# EAGLE design arm_driver (EAGLE 6.4)
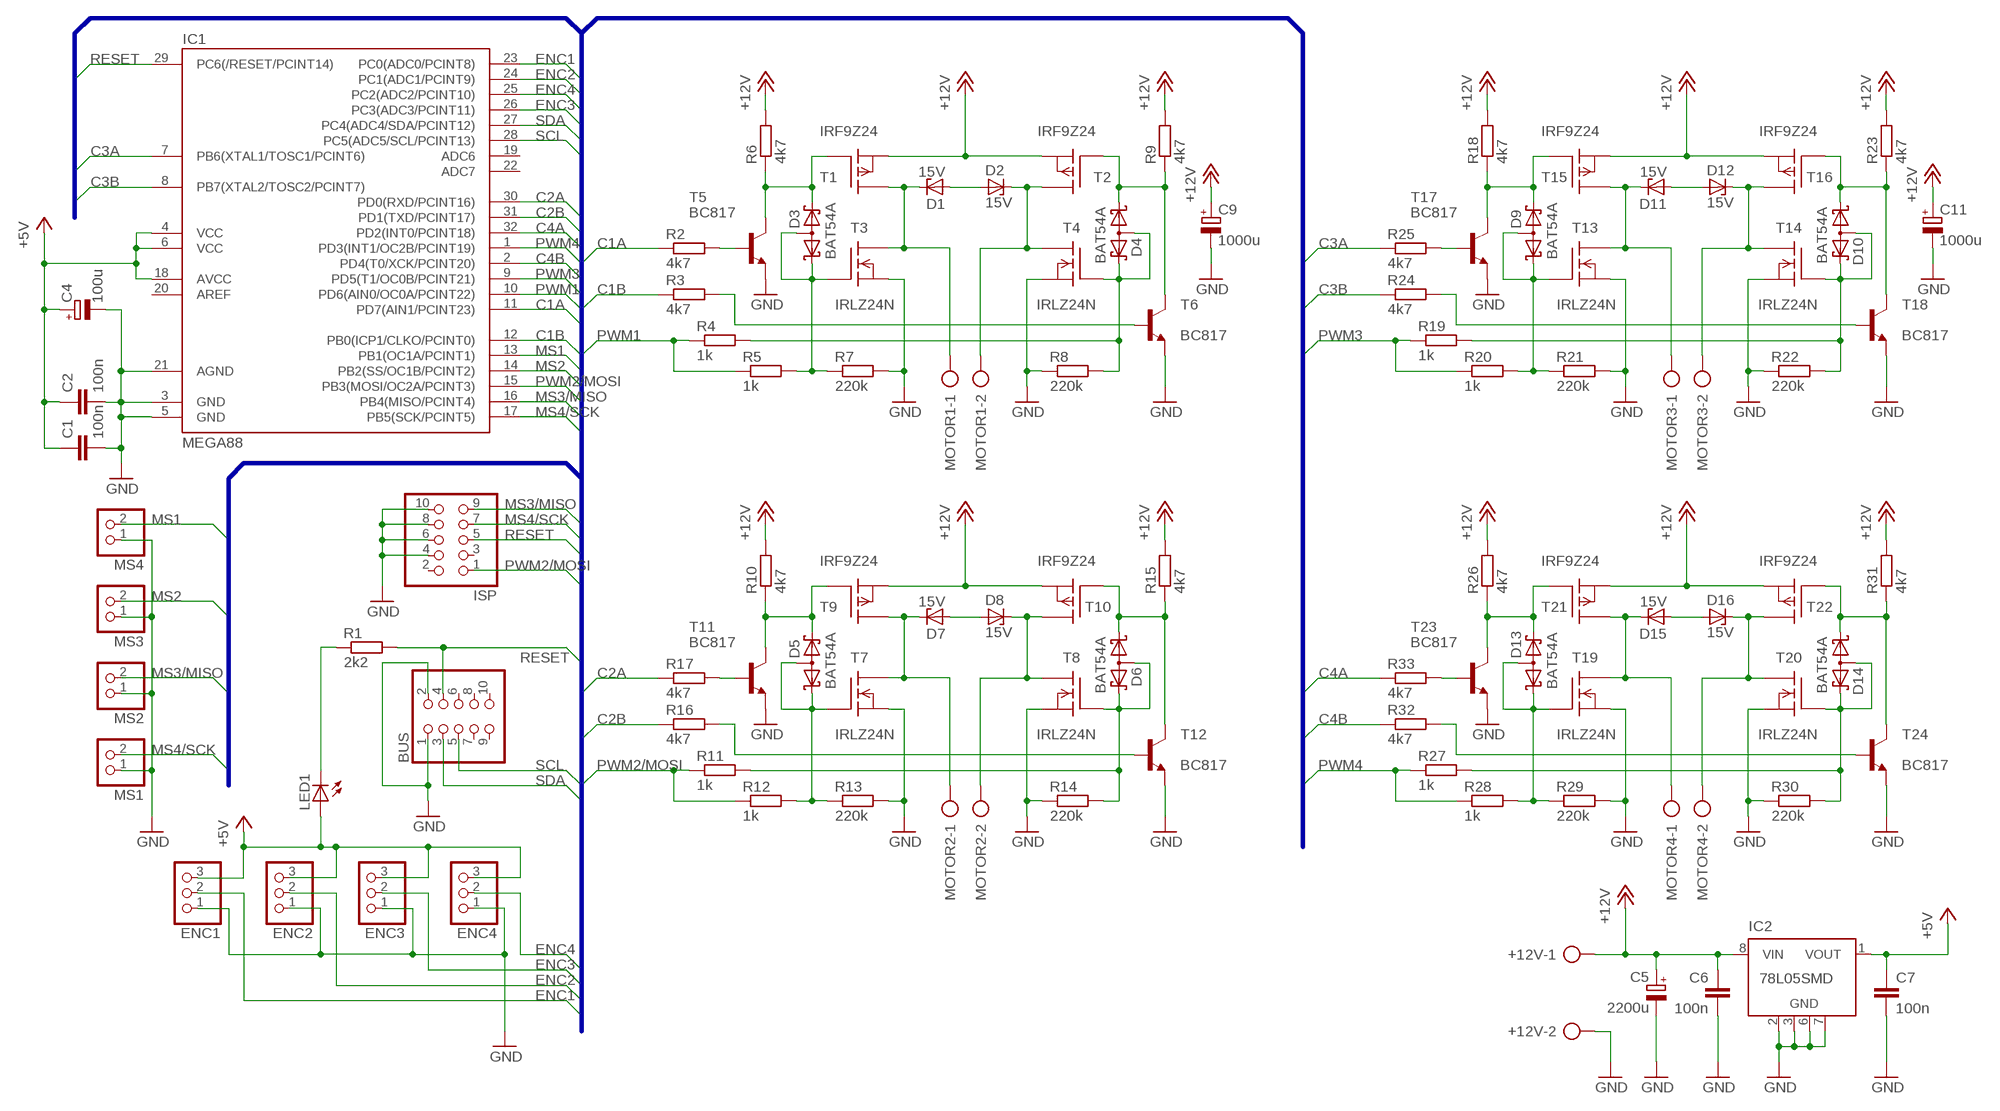
[diagram p0: schematic, sheet 1]

## Parts
+12V  AK500/2  [AK500/2]
BUS  PINHD-2X5  [2X05]
C1  100n  C-EUC1206  [C1206]
C2  100n  C-EUC1206  [C1206]
C4  100u  CPOL-EUD/7343-31R  [D/7343-31R]
C5  2200u  CPOL-EUE7.5-16  [E7,5-16]
C6  100n  C-EUC1206  [C1206]
C7  100n  C-EUC1206  [C1206]
C9  1000u  CPOL-EUE5-13  [E5-13]
C11  1000u  CPOL-EUE5-13  [E5-13]
D1  15V  ZENER-DIODESOD80C  [SOD80C]
D2  15V  ZENER-DIODESOD80C  [SOD80C]
D3  BAT54A  [SOT23]
D4  BAT54A  [SOT23]
D5  BAT54A  [SOT23]
D6  BAT54A  [SOT23]
D7  15V  ZENER-DIODESOD80C  [SOD80C]
D8  15V  ZENER-DIODESOD80C  [SOD80C]
D9  BAT54A  [SOT23]
D10  BAT54A  [SOT23]
D11  15V  ZENER-DIODESOD80C  [SOD80C]
D12  15V  ZENER-DIODESOD80C  [SOD80C]
D13  BAT54A  [SOT23]
D14  BAT54A  [SOT23]
D15  15V  ZENER-DIODESOD80C  [SOD80C]
D16  15V  ZENER-DIODESOD80C  [SOD80C]
ENC1  PINHD-1X3  [1X03]
ENC2  PINHD-1X3  [1X03]
ENC3  PINHD-1X3  [1X03]
ENC4  PINHD-1X3  [1X03]
IC1  MEGA88  MEGA48/88/168-AU  [TQFP32-08]
IC2  78L05SMD  [SO08]
ISP  PINHD-2X5  [2X05]
LED1  LEDKA-3528ASYC  [KA-3528ASYC]
MOTOR1  AK500/2  [AK500/2]
MOTOR2  AK500/2  [AK500/2]
MOTOR3  AK500/2  [AK500/2]
MOTOR4  AK500/2  [AK500/2]
MS1  PINHD-1X2  [1X02]
MS2  PINHD-1X2  [1X02]
MS3  PINHD-1X2  [1X02]
MS4  PINHD-1X2  [1X02]
R1  2k2  R-EU_R1206  [R1206]
R2  4k7  R-EU_R1206  [R1206]
R3  4k7  R-EU_R1206  [R1206]
R4  1k  R-EU_R1206  [R1206]
R5  1k  R-EU_R1206  [R1206]
R6  4k7  R-EU_R1206  [R1206]
R7  220k  R-EU_R1206  [R1206]
R8  220k  R-EU_R1206  [R1206]
R9  4k7  R-EU_R1206  [R1206]
R10  4k7  R-EU_R1206  [R1206]
R11  1k  R-EU_R1206  [R1206]
R12  1k  R-EU_R1206  [R1206]
R13  220k  R-EU_R1206  [R1206]
R14  220k  R-EU_R1206  [R1206]
R15  4k7  R-EU_R1206  [R1206]
R16  4k7  R-EU_R1206  [R1206]
R17  4k7  R-EU_R1206  [R1206]
R18  4k7  R-EU_R1206  [R1206]
R19  1k  R-EU_R1206  [R1206]
R20  1k  R-EU_R1206  [R1206]
R21  220k  R-EU_R1206  [R1206]
R22  220k  R-EU_R1206  [R1206]
R23  4k7  R-EU_R1206  [R1206]
R24  4k7  R-EU_R1206  [R1206]
R25  4k7  R-EU_R1206  [R1206]
R26  4k7  R-EU_R1206  [R1206]
R27  1k  R-EU_R1206  [R1206]
R28  1k  R-EU_R1206  [R1206]
R29  220k  R-EU_R1206  [R1206]
R30  220k  R-EU_R1206  [R1206]
R31  4k7  R-EU_R1206  [R1206]
R32  4k7  R-EU_R1206  [R1206]
R33  4k7  R-EU_R1206  [R1206]
T1  IRF9Z24  IRF9530  [TO220]
T2  IRF9Z24  IRF9530  [TO220]
T3  IRLZ24N  IRF540  [TO220]
T4  IRLZ24N  IRF540  [TO220]
T5  BC817  BC817-16-NPN-SOT23-BEC  [SOT23-BEC]
T6  BC817  BC817-16-NPN-SOT23-BEC  [SOT23-BEC]
T7  IRLZ24N  IRF540  [TO220]
T8  IRLZ24N  IRF540  [TO220]
T9  IRF9Z24  IRF9530  [TO220]
T10  IRF9Z24  IRF9530  [TO220]
T11  BC817  BC817-16-NPN-SOT23-BEC  [SOT23-BEC]
T12  BC817  BC817-16-NPN-SOT23-BEC  [SOT23-BEC]
T13  IRLZ24N  IRF540  [TO220]
T14  IRLZ24N  IRF540  [TO220]
T15  IRF9Z24  IRF9530  [TO220]
T16  IRF9Z24  IRF9530  [TO220]
T17  BC817  BC817-16-NPN-SOT23-BEC  [SOT23-BEC]
T18  BC817  BC817-16-NPN-SOT23-BEC  [SOT23-BEC]
T19  IRLZ24N  IRF540  [TO220]
T20  IRLZ24N  IRF540  [TO220]
T21  IRF9Z24  IRF9530  [TO220]
T22  IRF9Z24  IRF9530  [TO220]
T23  BC817  BC817-16-NPN-SOT23-BEC  [SOT23-BEC]
T24  BC817  BC817-16-NPN-SOT23-BEC  [SOT23-BEC]

## Nets
+5V: C1.1 C2.1 C4.+ C7.1 ENC1.3 ENC2.3 ENC3.3 ENC4.3 IC1.4(VCC) IC1.6(VCC) IC1.18(AVCC) IC2.1(VOUT) LED1.A
+12V: +12V.1 C5.+ C6.1 C9.+ C11.+ IC2.8(VIN) R6.2 R9.2 R10.2 R15.2 R18.2 R23.2 R26.2 R31.2 T1.3(S) T2.3(S) T9.3(S) T10.3(S) T15.3(S) T16.3(S) T21.3(S) T22.3(S)
C1A: IC1.11(PD7(AIN1/PCINT23)) R2.1
C1B: IC1.12(PB0(ICP1/CLKO/PCINT0)) R3.1
C2A: IC1.30(PD0(RXD/PCINT16)) R17.1
C2B: IC1.31(PD1(TXD/PCINT17)) R16.1
C3A: IC1.7(PB6(XTAL1/TOSC1/PCINT6)) R25.1
C3B: IC1.8(PB7(XTAL2/TOSC2/PCINT7)) R24.1
C4A: IC1.32(PD2(INT0/PCINT18)) R33.1
C4B: IC1.2(PD4(T0/XCK/PCINT20)) R32.1
ENC1: ENC1.2 IC1.23(PC0(ADC0/PCINT8))
ENC2: ENC2.2 IC1.24(PC1(ADC1/PCINT9))
ENC3: ENC3.2 IC1.26(PC3(ADC3/PCINT11))
ENC4: ENC4.2 IC1.25(PC2(ADC2/PCINT10))
GND: +12V.2 BUS.1 BUS.2 C1.2 C2.2 C4.- C5.- C6.2 C7.2 C9.- C11.- ENC1.1 ENC2.1 ENC3.1 ENC4.1 IC1.3(GND) IC1.5(GND) IC1.21(AGND) IC2.2(GND) IC2.3(GND) IC2.6(GND) IC2.7(GND) ISP.4 ISP.6 ISP.8 ISP.10 MS1.1 MS2.1 MS3.1 MS4.1 R7.2 R8.1 R13.2 R14.1 R21.2 R22.1 R29.2 R30.1 T3.3(S) T4.3(S) T5.E T6.E T7.3(S) T8.3(S) T11.E T12.E T13.3(S) T14.3(S) T17.E T18.E T19.3(S) T20.3(S) T23.E T24.E
MS1: IC1.13(PB1(OC1A/PCINT1)) MS4.2
MS2: IC1.14(PB2(SS/OC1B/PCINT2)) MS3.2
MS3/MISO: IC1.16(PB4(MISO/PCINT4)) ISP.9 MS2.2
MS4/SCK: IC1.17(PB5(SCK/PCINT5)) ISP.7 MS1.2
N$1: LED1.C R1.1
N$2: D2.C MOTOR1.2 T2.2(D) T4.2(D)
N$3: D1.A D2.A
N$4: D3.2(K2) R6.1 T1.1(G) T5.C
N$5: D4.1(K1) R9.1 T2.1(G) T6.C
N$6: D4.2(K2) D4.3(AA) R4.2 R8.2 T4.1(G)
N$8: R3.2 T6.B
N$9: R2.2 T5.B
N$10: D3.1(K1) D3.3(AA) R5.2 R7.1 T3.1(G)
N$14: D1.C MOTOR1.1 T1.2(D) T3.2(D)
N$17: D7.C MOTOR2.1 T7.2(D) T9.2(D)
N$18: D8.C MOTOR2.2 T8.2(D) T10.2(D)
N$19: D5.2(K2) R10.1 T9.1(G) T11.C
N$20: D6.1(K1) R15.1 T10.1(G) T12.C
N$21: D6.2(K2) D6.3(AA) R11.2 R14.2 T8.1(G)
N$22: D5.1(K1) D5.3(AA) R12.2 R13.1 T7.1(G)
N$23: D7.A D8.A
N$25: R16.2 T12.B
N$26: R17.2 T11.B
N$27: D11.C MOTOR3.1 T13.2(D) T15.2(D)
N$28: D12.C MOTOR3.2 T14.2(D) T16.2(D)
N$29: D9.2(K2) R18.1 T15.1(G) T17.C
N$30: D10.1(K1) R23.1 T16.1(G) T18.C
N$31: D10.2(K2) D10.3(AA) R19.2 R22.2 T14.1(G)
N$32: D9.1(K1) D9.3(AA) R20.2 R21.1 T13.1(G)
N$33: D11.A D12.A
N$35: R24.2 T18.B
N$36: R25.2 T17.B
N$37: D15.C MOTOR4.1 T19.2(D) T21.2(D)
N$38: D16.C MOTOR4.2 T20.2(D) T22.2(D)
N$39: D13.2(K2) R26.1 T21.1(G) T23.C
N$40: D14.1(K1) R31.1 T22.1(G) T24.C
N$41: D14.2(K2) D14.3(AA) R27.2 R30.2 T20.1(G)
N$42: D13.1(K1) D13.3(AA) R28.2 R29.1 T19.1(G)
N$43: D15.A D16.A
N$45: R32.2 T24.B
N$46: R33.2 T23.B
PWM1: IC1.10(PD6(AIN0/OC0A/PCINT22)) R4.1 R5.1
PWM2/MOSI: IC1.15(PB3(MOSI/OC2A/PCINT3)) ISP.1 R11.1 R12.1
PWM3: IC1.9(PD5(T1/OC0B/PCINT21)) R19.1 R20.1
PWM4: IC1.1(PD3(INT1/OC2B/PCINT19)) R27.1 R28.1
RESET: BUS.4 IC1.29(PC6(/RESET/PCINT14)) ISP.5 R1.2
SCL: BUS.5 IC1.28(PC5(ADC5/SCL/PCINT13))
SDA: BUS.3 IC1.27(PC4(ADC4/SDA/PCINT12))
Unconnected: BUS.6 BUS.7 BUS.8 BUS.9 BUS.10 IC1.19(ADC6) IC1.20(AREF) IC1.22(ADC7) IC2.4(NC) IC2.5(NC) ISP.2 ISP.3

## Buses
B$1

## Library data of the parts
+12V MOTOR1-MOTOR4 = con-ptr500:AK500/2: CONNECTOR; OC_FARNELL: unknown; OC_NEWARK: unknown
BUS ISP = pinhead:PINHD-2X5: PIN HEADER
C1 C2 C6 C7 = rcl:C-EU: CAPACITOR, European symbol
C4 C5 C9 C11 = rcl:CPOL-EU: POLARIZED CAPACITOR, European symbol
D1 D2 D7 D8 D11 D12 D15 D16 = diode:ZENER-DIODE: Z-Diode
D3-D6 D9 D10 D13 D14 = diode:BAT54A: Schottky Diodes Source: Fairchild .. BAT54.pdf
ENC1-ENC4 = pinhead:PINHD-1X3: PIN HEADER
IC1 = avr-6:MEGA48/88/168
IC2 = linear:78L*SMD: Positive VOLTAGE REGULATOR
LED1 = led:LED: LED OSRAM: - CHIPLED LG R971, LG N971, LY N971, LG Q971, LY Q971, LO R971, LY R971 LH N974, LH R974 LS Q976, LO Q976, LY Q976 LO Q996 - Hyper CHIPLED LW Q18S LB Q993, LB Q99A, LB R99A - SideLED LS A670, LO A670, LY A670, LG A670, LP A670 LB A673, LV A673, LT A673, LW A673 LH A674 LY A675 LS A676, LA A676, LO A676, LY A676, LW A676 LS A679, LY A679, LG A679 - Hyper Micro SIDELED® LS Y876, LA Y876, LO Y876, LY Y876 LT Y87S - SmartLED LW L88C, LW L88S LB L89C, LB L89S, LG L890 LS L89K, LO L89K, LY L89K LS L896, LA L896, LO L896, LY L896 - TOPLED LS T670, LO T670, LY T670, LG T670, LP T670 LSG T670, LSP T670, LSY T670, LOP T670, LYG T670 LG T671, LOG T671, LSG T671 LB T673, LV T673, LT T673, LW T673 LH T674 LS T676, LA T676, LO T676, LY T676, LB T676, LH T676, LSB T676, LW T676 LB T67C, LV T67C, LT T67C, LS T67K, LO T67K, LY T67K, LW E67C LS E67B, LA E67B, LO E67B, LY E67B, LB E67C, LV E67C, LT E67C LW T67C LS T679, LY T679, LG T679 LS T770, LO T770, LY T770, LG T770, LP T770 LB T773, LV T773, LT T773, LW T773 LH T774 LS E675, LA E675, LY E675, LS T675 LS T776, LA T776, LO T776, LY T776, LB T776 LHGB T686 LT T68C, LB T68C - Hyper Mini TOPLED® LB M676 - Mini TOPLED Santana® LG M470 LS M47K, LO M47K, LY M47K Source: http://www.osram.convergy.de LUXEON: - LUMILED® LXK2-PW12-R00, LXK2-PW12-S00, LXK2-PW14-U00, LXK2-PW14-V00 LXK2-PM12-R00, LXK2-PM12-S00, LXK2-PM14-U00 LXK2-PE12-Q00, LXK2-PE12-R00, LXK2-PE12-S00, LXK2-PE14-T00, LXK2-PE14-U00 LXK2-PB12-K00, LXK2-PB12-L00, LXK2-PB12-M00, LXK2-PB14-N00, LXK2-PB14-P00, LXK2-PB14-Q00 LXK2-PR12-L00, LXK2-PR12-M00, LXK2-PR14-Q00, LXK2-PR14-R00 LXK2-PD12-Q00, LXK2-PD12-R00, LXK2-PD12-S00 LXK2-PH12-R00, LXK2-PH12-S00 LXK2-PL12-P00, LXK2-PL12-Q00, LXK2-PL12-R00 Source: www.luxeon.com KINGBRIGHT: KA-3528ASYC Source: www.kingbright.com
MS1-MS4 = pinhead:PINHD-1X2: PIN HEADER
R1-R33 = rcl:R-EU_: RESISTOR, European symbol
T1 T2 T9 T10 T15 T16 T21 T22 = transistor-fet:IRF9530: P-Channel Enhancement MOSFET (HEXFET); -100V; -12A; 0,3Ohm
T3 T4 T7 T8 T13 T14 T19 T20 = transistor-fet:IRF540: N-Channel Enhancement MOSFET (HEXFET); 100V; 28A; 0,077Ohm
T5 T6 T11 T12 T17 T18 T23 T24 = transistor:*-NPN-: NPN Transistror BF959 corrected 2008.03.06

## Board
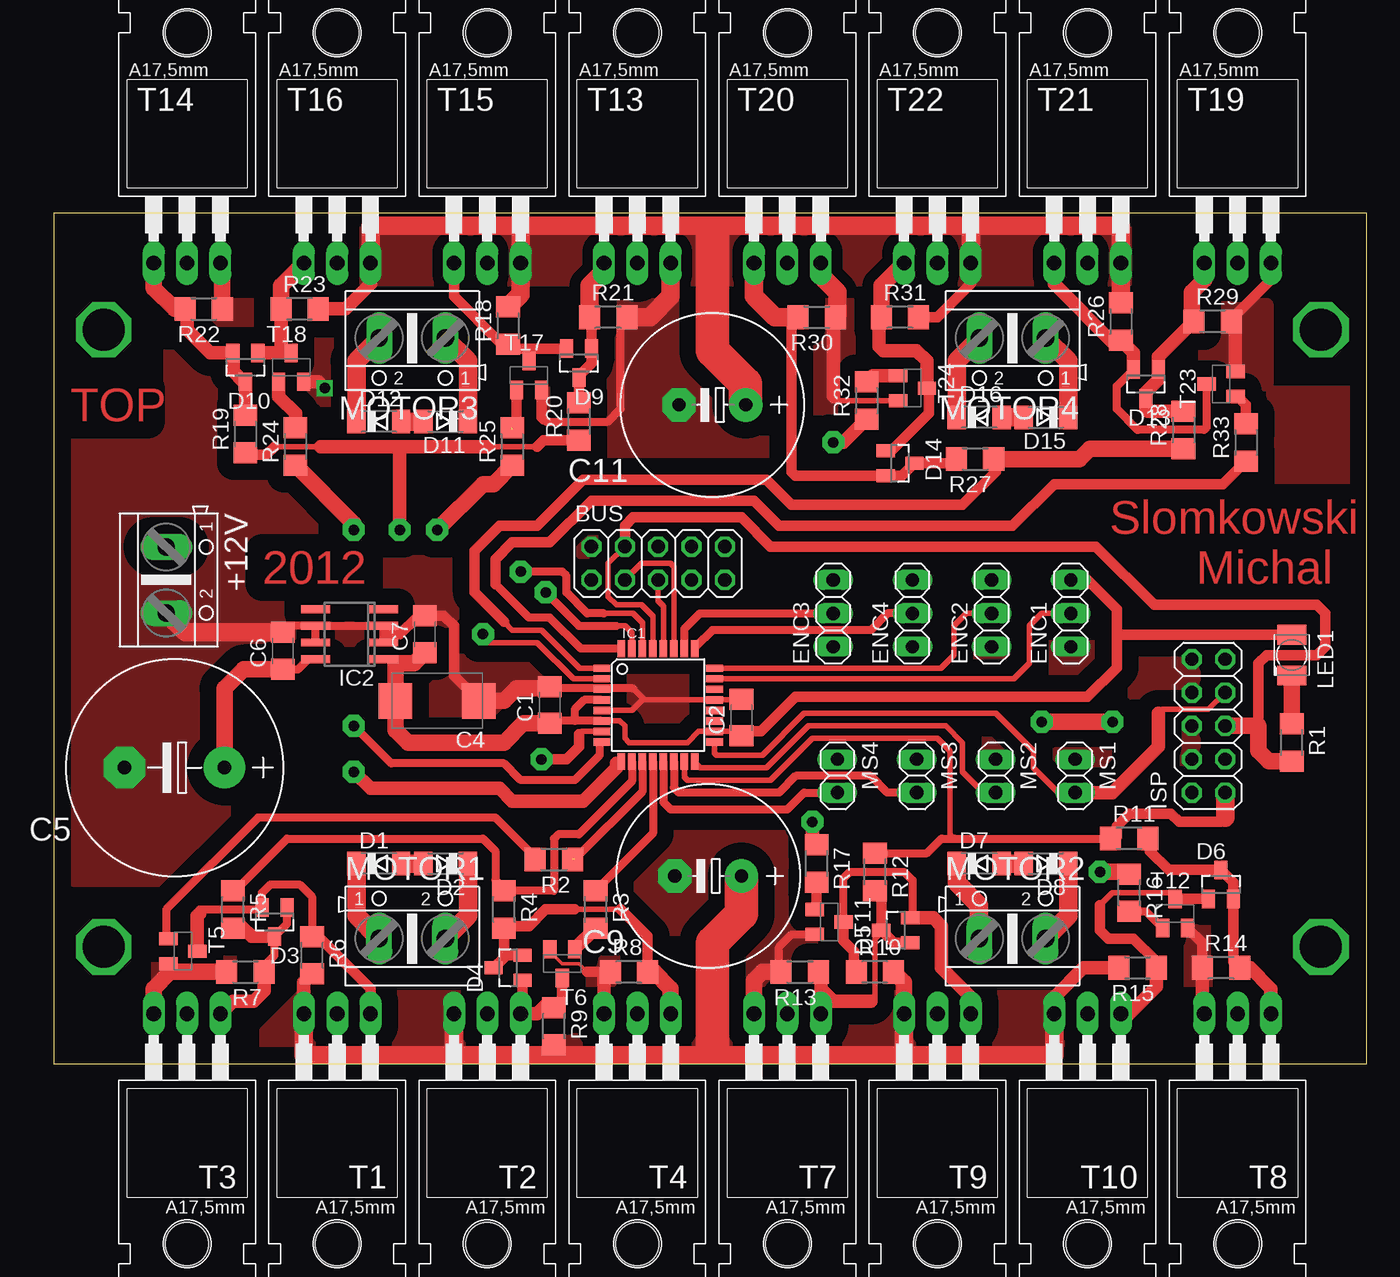
[diagram p1: board, top side]
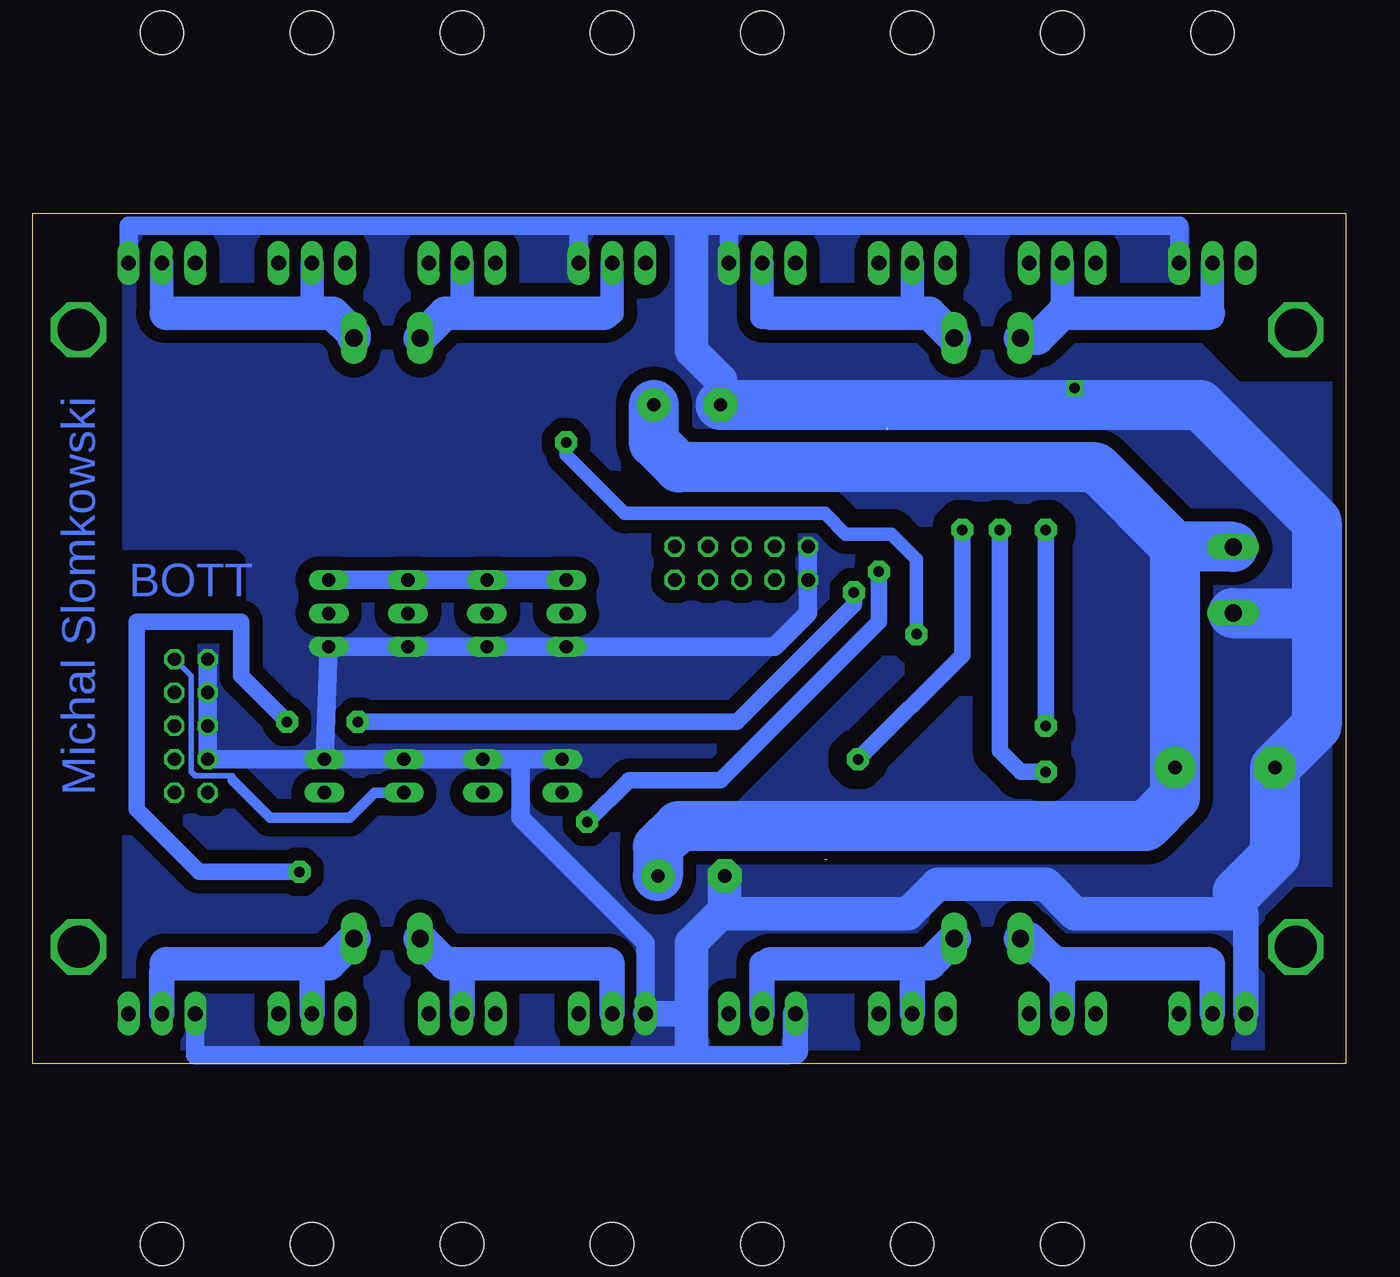
[diagram p2: board, bottom side, seen from below]

Size 100 x 64.76 mm. Coordinates in mm from the lower left corner, seen from the top.
Outline: 0,0 100,0 100,64.76 0,64.76 0,0
Copper layers (1*16): Top 0.035mm / dielectric 1.5mm / Bottom 0.035mm
Design rules "default": minimum track width 10mil, minimum drill 24mil, track to track 8mil, track to pad 8mil, pad to pad 8mil, via to via 8mil, smd to smd 8mil, copper to edge 40mil, drill to drill 8mil, minimum pad ring 10mil, minimum via ring 8mil, stop-mask expansion 4mil, vias tented up to drill 0mil, thermal gap 10mil

### Footprints (pad centres in the part's own frame; a part is rotated, then mirrored left to right if it is on the bottom)
AK500/2 = drill 1.321 long: 1 -2.515,0; 2 2.515,0
2X05 = drill 1.016 octagon: 1 -5.08,-1.27; 2 -5.08,1.27; 3 -2.54,-1.27; 4 -2.54,1.27; 5 0,-1.27; 6 0,1.27; 7 2.54,-1.27; 8 2.54,1.27; 9 5.08,-1.27; 10 5.08,1.27
C1206 = smd 1.6 x 1.8: 1 -1.4,0; 2 1.4,0
D/7343-31R = smd 2.55 x 2.7: + 3.175,0; - -3.175,0
E7,5-16 = drill 1.016 pad 3.15: + -3.81,0 | drill 1.016 pad 3.15 octagon: - 3.81,0
E5-13 = drill 1.016 pad 2.54: + -2.54,0 | drill 1.016 pad 2.54 octagon: - 2.54,0
SOD80C = smd 1.4 x 1.8: A 1.7,0; C -1.7,0
SOT23 = smd 1 x 1.4: 1 -0.95,-1.1; 2 0.95,-1.1; 3 0,1.1
1X03 = drill 1.016 long: 1 -2.54,0; 2 0,0; 3 2.54,0
TQFP32-08 = smd 1.27 x 0.559: 1 -4.293,2.8; 2 -4.293,2; 3 -4.293,1.2; 4 -4.293,0.4; 5 -4.293,-0.4; 6 -4.293,-1.2; 7 -4.293,-2; 8 -4.293,-2.8; 17 4.293,-2.8; 18 4.293,-2; 19 4.293,-1.2; 20 4.293,-0.4; 21 4.293,0.4; 22 4.293,1.2; 23 4.293,2; 24 4.293,2.8 | smd 0.559 x 1.27: 9 -2.8,-4.293; 10 -2,-4.293; 11 -1.2,-4.293; 12 -0.4,-4.293; 13 0.4,-4.293; 14 1.2,-4.293; 15 2,-4.293; 16 2.8,-4.293; 25 2.8,4.293; 26 2,4.293; 27 1.2,4.293; 28 0.4,4.293; 29 -0.4,4.293; 30 -1.2,4.293; 31 -2,4.293; 32 -2.8,4.293
SO08 = smd 0.6 x 2.2: 1 -1.905,-2.6; 2 -0.635,-2.6; 3 0.635,-2.6; 4 1.905,-2.6; 5 1.905,2.6; 6 0.635,2.6; 7 -0.635,2.6; 8 -1.905,2.6
KA-3528ASYC = smd 1.5 x 2.2: A -1.55,0; C 1.55,0
1X02 = drill 1.016 long: 1 -1.27,0; 2 1.27,0
R1206 = smd 1.6 x 1.803: 1 -1.422,0; 2 1.422,0
TO220 = drill 1.118 long: 1 -2.54,-6.35; 2 0,-6.35; 3 2.54,-6.35 | hole 3.302: 0,11.176
SOT23-BEC = smd 1 x 1.4: B -0.95,-1.1; C 0,1.1; E 0.95,-1.1

### Placement (x,y rotation side)
+12V  8.57,36.83 270 top
BUS  46.04,38.1 0 top
C1  37.78,27.3 90 top
C2  52.39,26.35 90 top
C4  29.21,27.62 180 top
C5  9.21,22.54 180 top
C6  17.46,31.43 90 top
C7  28.26,32.7 90 top
C9  49.85,14.29 180 top
C11  50.16,50.16 180 top
D1  24.77,15.24 0 top
D2  29.84,15.24 180 top
D3  16.83,10.79 180 top
D4  34.61,7.3 90 top
D5  64.14,10.16 90 top
D6  88.9,13.65 0 top
D7  70.48,15.24 0 top
D8  75.56,15.24 180 top
D9  40.01,53.34 180 top
D10  14.61,53.02 180 top
D11  29.84,48.9 180 top
D12  24.77,48.9 0 top
D13  83.19,51.75 180 top
D14  64.45,45.72 270 top
D15  75.56,49.21 180 top
D16  70.48,49.21 0 top
ENC1  77.47,34.29 90 top
ENC2  71.44,34.29 90 top
ENC3  59.37,34.29 90 top
ENC4  65.41,34.29 90 top
IC1  46.04,27.3 0 top
IC2  22.54,32.7 90 top
ISP  87.95,25.72 90 top
LED1  94.3,31.11 270 top
MOTOR1  27.3,9.53 0 top
MOTOR2  73.03,9.53 0 top
MOTOR3  27.3,55.24 180 top
MOTOR4  73.03,55.24 180 top
MS1  77.79,21.91 270 top
MS2  71.75,21.91 270 top
MS3  65.72,21.91 270 top
MS4  59.69,21.91 270 top
R1  94.3,24.45 270 top
R2  38.1,15.56 180 top
R3  41.27,11.75 270 top
R4  34.29,11.75 270 top
R5  13.65,11.75 270 top
R6  19.68,8.26 270 top
R7  14.61,6.99 180 top
R8  43.81,6.99 0 top
R9  38.1,2.86 270 top
R10  62.55,6.99 0 top
R11  81.92,17.14 0 top
R12  62.55,14.61 270 top
R13  56.83,6.99 180 top
R14  88.9,7.3 0 top
R15  82.55,7.3 180 top
R16  81.92,13.02 270 top
R17  58.1,15.24 270 top
R18  34.61,56.2 90 top
R19  14.61,47.94 90 top
R20  40.01,48.9 90 top
R21  42.23,56.83 0 top
R22  11.43,57.47 180 top
R23  18.73,57.47 0 top
R24  18.41,46.99 90 top
R25  34.92,46.99 90 top
R26  81.28,56.52 90 top
R27  70.17,46.04 180 top
R28  86.04,48.26 90 top
R29  88.27,56.52 0 top
R30  58.1,56.83 180 top
R31  64.45,56.83 0 top
R32  61.91,50.48 90 top
R33  90.81,47.31 90 top
T1  21.59,-2.54 180 top
T2  33.02,-2.54 180 top
T3  10.16,-2.54 180 top
T4  44.45,-2.54 180 top
T5  9.84,8.57 270 top
T6  38.73,7.62 180 top
T7  55.88,-2.54 180 top
T8  90.17,-2.54 180 top
T9  67.31,-2.54 180 top
T10  78.74,-2.54 180 top
T11  59.05,10.79 270 top
T12  85.41,11.43 0 top
T13  44.45,67.31 0 top
T14  10.16,67.31 0 top
T15  33.02,67.31 0 top
T16  21.59,67.31 0 top
T17  36.2,52.39 0 top
T18  18.1,53.02 0 top
T19  90.17,67.31 0 top
T20  55.88,67.31 0 top
T21  78.74,67.31 0 top
T22  67.31,67.31 0 top
T23  88.9,51.75 90 top
T24  65.41,51.44 270 top

### Tracks (layer width: path | path; a pad name or v marks a point on that pad's centre or on a via)
+5V
  Top 0.406: IC1.6 43.11,26.11 43.5,25.72 43.5,24.77 43.81,24.45 48.26,24.45 49.12,25.3 IC1.18 52.03,25.3 C2.1
  Top 0.61: IC1.6 39.69,26.11 | 39.69,26.11 37.98,26.11 C1.1 | IC1.4 40.41,27.7 39.69,26.99 39.69,26.11 | IC2.1 25.72,30.8 26.04,30.48
  Top 0.813: 52.03,25.3 53.88,25.3 56.52,27.94 78.74,27.94 80.96,30.16 80.96,32.7 | 80.96,32.7 80.96,34.61 78.74,36.83 ENC1.3 | LED1.A 81,32.66 80.96,32.7
  Top 1.27: C1.1 35.75,25.91 34.29,24.45 26.99,24.45 26.04,25.4 C4.+ 26.04,30.48 27.43,30.48 C7.1
  Bottom 1.422: ENC3.3 ENC4.3 ENC2.3 ENC1.3
+12V
  Top 0.406: R9.2 38.42,0.95 38.42,0.64
  Top 0.61: C6.1 18.6,30.03 19.37,30.8 IC2.8
  Top 0.813: T22.3 69.85,59.37 67.31,56.83 R31.2
  Top 1.016: T1.3 19.05,6.2 R6.2 | R15.2 78.42,7.3 76.2,5.08 T10.3 | T16.3 24.13,59.37 22.23,57.47 R23.2
  Top 1.27: T9.3 64.77,6.18 R10.2 | C6.1 14.47,30.03 13.02,28.57 C5.+
  Top 1.422: T1.3 19.05,0.64 30.48,0.64 | 30.48,0.64 T2.3 | T10.3 76.2,0.64 65.09,0.64 | 30.48,0.64 38.42,0.64 49.85,0.64 | 49.85,0.64 65.09,0.64 | T9.3 64.77,0.95 65.09,0.64 | 50.16,1.27 50.16,0.95 49.85,0.64 | 69.85,63.82 81.28,63.82 T21.3 R26.2 | 69.85,63.82 T22.3 | T16.3 24.13,63.82 35.56,63.82 | 35.56,63.82 50.16,63.82 | 50.16,63.82 69.85,63.82 | 35.56,63.82 T15.3 35.56,58.57 R18.2 | 50.16,63.82 50.16,63.18
  Top 2.54: C9.+ 52.39,11.43 50.16,9.21 50.16,1.27 | 50.16,63.18 50.16,54.29 52.7,51.75 C11.+
  Bottom 3.81: C9.+ 52.39,16.51 50.8,18.1 15.24,18.1 13.02,20.32 C5.+ 13.02,39.37 | +12V.1 12.99,39.34 13.02,39.37 | 13.02,39.37 19.05,45.4 50.8,45.4 52.7,47.31 C11.+
  pour Top (isolate 0.813, no thermals): 23.5,64.45 81.92,64.45 81.92,59.37 23.5,59.37
  pour Top (isolate 1.27, no thermals): 15.88,0.32 76.83,0.32 76.83,5.4 18.73,5.4 15.88,2.54
  pour Bottom (isolate 1.422, no thermals): 21.27,45.09 19.68,45.09 13.97,39.37 13.97,18.41 46.99,18.41 46.99,44.77 46.67,45.09
C1A  (1 unrouted)
  Top 0.61: IC1.11 44.84,20.71 39.69,15.56
C1B
  Top 0.61: IC1.12 45.64,17.53 R3.1
C2A  (via drill 0.8 pad 1.68)
  Top 0.406: IC1.30 44.84,33.59 44.13,34.29 41.91,34.29
  Top 0.61: 41.91,34.29 40.64,34.29 39.05,35.88 39.05,37.15 38.73,37.47 v35.56,37.47
  Top 1.016: v57.78,18.41 57.78,16.98 R17.1
  Bottom 1.27: v35.56,37.47 35.56,33.66 47.62,21.59 54.61,21.59 v57.78,18.41
C2B  (via drill 0.8 pad 1.68)
  Top 0.406: IC1.31 44.04,32.8 43.5,33.34 42.86,33.34
  Top 0.61: v37.47,35.88 40.01,33.34 42.86,33.34
  Top 1.27: v75.25,26.04 v80.64,26.04 | v79.69,14.61 81.75,14.61 R16.1
  Bottom 1.27: v75.25,26.04 46.35,26.04 37.47,34.92 v37.47,35.88 | v80.64,26.04 84.14,29.53 84.14,33.66 92.08,33.66 92.08,19.37 87.31,14.61 v79.69,14.61
C3A  (via drill 0.8 pad 1.68)
  Top 0.406: IC1.7 40.23,25.3 40.01,25.08
  Top 0.813: 40.01,25.08 40.01,24.13 39.05,23.18 v37.15,23.18
  Top 1.27: 34.77,45.57 R25.1 33.49,44.13 32.7,44.13 v29.21,40.64
  Bottom 1.27: v37.15,23.18 29.21,31.11 v29.21,40.64
C3B  (via drill 0.8 pad 1.68)
  Top 0.406: IC1.8 41.74,24.28 41.59,24.13
  Top 0.61: 41.59,24.13 41.59,23.5 39.69,21.59 35.56,21.59 34.29,22.86 25.72,22.86 v22.86,25.72
  Top 1.27: v22.86,40.64 22.86,41.12 R24.1
  Bottom 1.27: v22.86,25.72 v22.86,40.64
C4A
  Top 0.61: IC1.32 40.16,31.6 37.78,33.97 36.2,33.97 33.66,36.51
  Top 0.813: 33.66,36.51 33.66,38.42 34.92,39.69 37.78,39.69 40.96,42.86 53.34,42.86 55.24,40.96 73.03,40.96 76.2,44.13 89.05,44.13 R33.1
C4B  (via drill 0.8 pad 1.68)
  Top 0.406: IC1.2 39.59,29.3 36.83,32.07 33.02,32.07 v32.7,32.7
  Top 1.016: v59.37,47.31 60.16,47.31 R32.1
  Bottom 1.016: v32.7,32.7 32.7,38.42 34.61,40.32 38.1,40.32 39.69,41.91 54.93,41.91 59.37,46.35 v59.37,47.31
ENC1
  Top 0.406: IC1.23 73.12,29.3 74.3,30.48 74.3,33.34 75.25,34.29 ENC1.2
ENC2
  Top 0.406: IC1.24 67.57,30.11 68.58,31.11 68.58,33.34 69.53,34.29 ENC2.2
ENC3
  Top 0.61: IC1.26 48.04,33.12 49.21,34.29 ENC3.2
ENC4
  Top 0.406: IC1.25 48.84,31.69 48.9,31.75
  Top 0.61: ENC4.2 63.5,34.29 62.23,33.02 50.16,33.02 48.9,31.75
GND  (via drill 0.8)
  Top 0.254: T6.E 37.78,8.57 38.73,7.62 40.01,7.62 40.64,6.99
  Top 0.406: 44.93,27.78 44.13,28.57 41.81,28.57 IC1.3 | 44.93,27.78 45,27.7 IC1.21 52.39,27.7 C2.2 | IC1.5 44.05,26.91 44.93,27.78 | T24.E 59.37,50.48 59.37,50.8
  Top 0.61: T11.E 56.2,9.85 55.24,8.89 55.24,7.15 R13.2 | 37.3,49.06 37.47,48.9 42.23,48.9 43.18,49.85 43.18,56.36 R21.2 | 44.13,28.57 37.78,28.57 C1.2 | IC2.6 IC2.3 | IC2.7 IC2.6 | IC2.2 IC2.3 | IC2.6 17.97,33.34 C6.2 | IC2.3 25.14,32.96 25.4,32.7
  Top 0.813: T5.E 8.74,7.13 8.89,6.99 | R14.1 87.48,9.21 T12.E | 40.64,6.99 R8.1 | T19.3 92.71,59.69 89.85,56.83 89.85,56.68 R29.2 | T17.E 37.15,49.22 37.3,49.06 | C4.- 30.48,29.53 30.48,33.34 29.71,34.1 C7.2 28.13,33.97 27.62,33.97 26.35,32.7 25.4,32.7
  Top 1.016: R14.1 87.48,3.96 T8.3 | T4.3 41.91,6.5 R8.1 | T23.E 90,56.2 R29.2 | 59.37,50.8 59.37,56.68 R30.1 | T18.E 20.15,51.92 v20.64,51.44
  Top 1.27: R7.2 8.89,6.99 7.62,5.71 T3.3 | T7.3 53.34,6.35 53.98,6.99 R13.2 | R22.1 12.85,60.81 T14.3 | 37.78,28.57 35.24,28.57 34.29,27.62 C4.-
  Top 1.422: R21.2 45.4,56.83 46.99,58.42 T13.3 | T20.3 58.42,60.01 59.69,58.74 59.69,57 R30.1 | C6.2 10.05,32.83 +12V.2
  Bottom 1.016: v20.64,51.44 20.64,50.48 20.95,50.16
  Bottom 1.422: 41.91,0.95 42.23,0.95 42.55,0.64 49.85,0.64 49.85,0.95 | 49.85,1.27 49.85,0.95 | 49.85,0.95 50.16,0.64 87.63,0.64 T8.3 | T19.3 92.71,63.82 58.42,63.82 | 58.42,63.82 T20.3 | 46.99,63.82 T13.3 | 46.99,63.82 50.16,63.82 | 50.16,63.82 58.42,63.82 | T14.3 12.7,63.82 46.99,63.82 | 49.85,63.18 49.85,63.5 50.16,63.82 | MS1.1 MS2.1 MS3.1 MS4.1 62.87,23.18 62.87,18.73 53.34,9.21 T7.3 | MS1.1 ISP.4 ISP.6 ISP.8 ISP.10 | MS1.1 ENC1.1 ENC2.1 ENC4.1 ENC3.1 43.5,31.75 40.96,34.29 BUS.1 BUS.2
  Bottom 1.676: 8.26,13.02 8.26,11.43
  Bottom 1.93: T3.3 7.62,11.11 7.94,11.43 | 49.85,3.81 T7.3 | 41.91,0.95 T4.3
  Bottom 2.54: 7.94,11.43 8.26,11.43 20.64,11.43 22.86,13.65 31.11,13.65 33.34,11.43 47.31,11.43 | 47.31,11.43 47.62,11.43 49.85,9.21 49.85,3.81 49.85,1.27 | 47.31,11.43 C9.- | 49.85,63.18 49.85,54.29 47.62,52.07 C11.-
  Bottom 3.81: 8.26,13.02 5.4,15.88 C5.- 2.22,25.72 2.22,33.97 | C11.- 20.95,50.16 11.11,50.16 2.22,41.27 2.22,33.97 | +12V.2 2.56,34.31 2.22,33.97
  pour Bottom (isolate 1.016, no thermals): 13.02,63.82 92.71,63.82 92.71,58.1 92.71,0.64 7.62,0.64 6.67,0.64 6.67,11.43 4.13,13.97 0.64,13.97 0.64,51.44 8.26,51.44 12.38,55.56 12.38,63.82
  pour Top (isolate 1.27, no thermals): 8.89,57.78 92.39,57.78 92.39,51.12 99.38,51.12 99.38,14.61 92.71,14.61 92.71,6.35 7.94,6.35 7.94,13.65 7.94,13.97 1.59,13.97 1.59,51.44 8.89,51.44
MS1
  Top 0.61: IC1.13 46.44,19.92 46.99,19.37 55.88,19.37 57.15,20.64 MS4.2
MS2
  Top 0.61: MS3.2 63.5,20.64 62.23,21.91 56.52,21.91 55.24,20.64 47.62,20.64 47.24,21.02 IC1.14
MS3/MISO
  Top 0.406: IC1.16 48.84,22.92 49.21,22.54 54.29,22.54 57.47,25.72 67.94,25.72 69.22,24.45 69.22,22.23 70.48,20.95 71.44,20.95 MS2.2
  Bottom 0.406: 84.77,21.59 84.77,21.91 87.63,21.91 87.95,22.23 87.95,29.53 ISP.9
  Bottom 0.813: MS2.2 73.98,20.64 75.88,18.73 81.92,18.73 84.77,21.59
MS4/SCK
  Top 0.406: IC1.17 50.33,23.65 50.48,23.5 53.98,23.5 57.15,26.67 71.75,26.67 74.61,23.81 74.61,22.54 76.52,20.64 MS1.2 | 84.14,26.67 84.45,26.99 87.95,26.99 ISP.7
  Top 1.016: MS1.2 80.64,20.64 84.14,24.13 84.14,26.67
N$1
  Top 1.27: LED1.C R1.1
N$2
  Top 1.422: D2.C 31.55,11.25 MOTOR1.2
  Bottom 1.93: T2.2 33.02,7.62 | T4.2 44.45,7.62 43.81,7.62
  Bottom 2.54: 43.81,7.62 33.02,7.62 31.73,7.62 MOTOR1.2
N$3
  Top 1.422: D1.A D2.A
N$4
  Top 0.406: D3.2 15.71,11.89 15.56,11.75
  Top 0.61: 15.56,11.75 11.11,11.75 11.11,11.43 | D3.2 15.88,13.02 16.51,13.65 18.73,13.65 19.68,12.7 R6.1
  Top 0.813: T1.1 24.13,5.71 20.32,9.53 19.84,9.53 R6.1
  Top 1.016: T5.C 10.94,11.26 11.11,11.43
N$5
  Top 0.813: T6.C 38.73,4.92 R9.1 | D4.1 35.71,3.96 T2.1
  Top 1.016: T2.1 36.83,3.81 37.47,4.45 37.93,4.45 R9.1
N$6
  Top 0.406: 43.18,11.75 39.69,11.75
  Top 0.813: D4.2 34.46,8.25 34.29,8.09 | 34.29,8.09 D4.3 | 34.29,8.09 R4.2 34.44,10.48 36.2,10.48 37.47,11.75 39.69,11.75 | R8.2 45.24,9.69 43.18,11.75
  Top 1.27: T4.1 46.99,5.71 45.72,6.99 R8.2
N$8
  Top 1.016: T6.B 39.69,8.74 R3.2
N$9
  Top 0.61: R2.2 36.68,15.71 33.66,18.73 15.56,18.73 8.57,11.75 8.57,9.69 T5.B
N$10
  Top 0.61: D3.1 17.78,10.64 D3.3 16.83,8.26 16.19,7.62 16.19,7.15 R7.1
  Top 1.016: R7.1 16.03,5.55 15.24,4.76 13.65,4.76 T3.1 | D3.3 15.07,9.7 14.29,10.48 13.8,10.48 R5.2
N$12  (via drill 3.2)
  other vias: 3.81,8.89
N$13  (via drill 3.2)
  other vias: 96.52,8.89
N$14
  Top 1.422: D1.C 23.07,11.25 MOTOR1.1
  Bottom 1.93: 21.59,7.62 21.59,6.99 T1.2 | T3.2 10.16,7.3 10.48,7.62
  Bottom 2.54: 10.48,7.62 21.59,7.62 | MOTOR1.1 24.13,9.53 21.59,6.99
N$15  (via drill 3.2)
  other vias: 96.52,55.88
N$16  (via drill 3.2)
  other vias: 3.81,55.88
N$17
  Top 1.422: D7.C 68.78,13.77 70.48,12.06 70.48,9.55 MOTOR2.1
  Bottom 1.93: T7.2 55.88,7.3 | 55.88,7.3 55.88,7.62 | T9.2 67.31,7.3 66.99,7.62 | 55.88,7.3 56.2,7.62
  Bottom 2.54: MOTOR2.1 68.61,7.62 66.99,7.62 56.2,7.62
N$18
  Top 1.422: D8.C 77.27,11.25 MOTOR2.2
  Bottom 1.93: T10.2 78.74,7.62 | T8.2 90.17,6.99 89.85,7.62
  Bottom 2.54: MOTOR2.2 77.44,7.62 78.74,7.62 89.85,7.62
N$19
  Top 0.61: T11.C 60.16,14.12 60.64,14.61 64.77,14.61 65.41,13.97 65.41,11.28 D5.2
  Top 0.813: T11.C 60.16,9.38 60.96,8.57 60.96,7.15 R10.1
  Top 1.016: D5.2 67,11.11 67.63,10.48 67.63,7.3 69.85,5.08 T9.1
N$20
  Top 0.406: 79.69,12.06 80.64,13.02 84.92,13.02 T12.C
  Top 0.813: R15.1 83.97,7.79 82.23,9.53 80.33,9.53 79.69,10.16 79.69,12.06 | D6.1 85.43,12.55 T12.C
  Top 1.016: R15.1 83.97,5.87 81.92,3.81 T10.1
N$21
  Top 0.813: R11.2 83.5,16.66 83.5,16.19 84.94,14.75 D6.3 89.85,13.8 D6.2 89.85,7.77 R14.2
  Top 1.016: T8.1 92.71,5.71 91.12,7.3 R14.2
N$22
  Top 0.406: D5.3 63.03,10.01 62.55,9.53 62.55,4.76 62.23,4.76
  Top 0.813: D5.1 63.98,9.21 D5.3 63.03,12.7 R12.2
  Top 1.016: 58.42,5.71 58.42,6.82 R13.1 | 58.42,5.71 T7.1 | 62.23,4.76 59.37,4.76 58.42,5.71
N$23
  Top 1.422: D7.A D8.A
N$25
  Top 0.61: R16.2 83.19,11.6 T12.B
N$26
  Top 0.813: T11.B 58.1,11.74 R17.2
N$27
  Top 1.422: D11.C 31.55,53.52 MOTOR3.1
  Bottom 1.778: T13.2 44.45,56.83 43.81,57.15 | T15.2 33.02,57.47 33.34,57.15
  Bottom 2.54: 43.81,57.15 33.34,57.15 31.73,57.15 MOTOR3.1
N$28
  Top 1.422: D12.C 23.07,53.52 MOTOR3.2
  Bottom 1.778: T14.2 10.16,56.83 10.48,57.15 | 21.59,57.15 T16.2
  Bottom 2.54: 10.48,57.15 21.59,57.15 23.5,55.24 MOTOR3.2
N$29
  Top 0.813: T15.1 30.48,58.42 33.97,54.93 34.46,54.93 R18.1 34.94,54.44 36.51,54.44 | D9.2 36.51,54.44 | T17.C 36.2,54.12 36.51,54.44
N$30
  Top 1.016: T18.C 17.14,54.12 | 17.14,54.12 D10.1 | R23.1 17.31,54.29 17.14,54.12
  Top 1.27: R23.1 17.31,59.22 T16.1
N$31
  Top 1.016: R22.2 10.16,57.32 10.16,55.88 11.92,54.12 D10.2 13.65,52.7 14.44,51.92 D10.3 R19.2
  Top 1.27: T14.1 7.62,59.05 9.21,57.47 R22.2
N$32
  Top 0.813: R21.1 40.95,56.68 D9.1 40.96,53.34 40.01,52.39 D9.3 R20.2
  Top 1.422: R21.1 40.81,59.22 41.91,60.33 T13.1
N$33
  Top 1.422: D12.A D11.A
N$35
  Top 1.016: T18.B 17.15,50.8 18.41,49.53 18.41,49.21 R24.2 18.41,48.26
N$36  (1 unrouted)
  Top 0.813: T17.B 35.24,48.58 34.92,48.58 | 34.92,48.58 34.61,48.58 34.61,48.26 34.92,48.26 34.92,48.58
N$37
  Top 1.422: D15.C 77.27,53.52 MOTOR4.1
  Bottom 1.778: 89.85,57.15 90.17,57.47 T19.2 | T21.2 78.74,57.47 78.42,57.15
  Bottom 2.54: MOTOR4.1 75.54,55.54 77.15,57.15 78.42,57.15 89.85,57.15
N$38
  Top 1.422: D16.C 68.78,53.52 MOTOR4.2
  Bottom 1.778: T20.2 55.88,57.15 56.52,57.15 | T22.2 67.31,57.47 67.63,57.15
  Bottom 2.54: 56.52,57.15 67.63,57.15 68.61,57.15 MOTOR4.2
N$39
  Top 0.61: T23.C 87.8,48.43 87.63,48.26 82.55,48.26 80.96,49.85 80.96,51.58 D13.2
  Top 1.016: T21.1 76.2,59.37 80.64,54.93 81.11,54.93 R26.1 82.23,54.14 D13.2
N$40
  Top 0.813: D14.1 63.81,46.67 66.67,49.53 66.67,51.27 T24.C
  Top 1.016: T24.C 66.5,53.51 65.72,54.29 63.18,54.29 62.87,54.61 62.87,56.67 R31.1
  Top 1.27: R31.1 63.03,59.22 T22.1
N$41
  Top 0.813: R30.2 56.2,56.35 56.2,45.09 56.51,44.77 D14.2 64.6,44.77 D14.3 68.43,45.72 R27.2
  Top 1.422: T20.1 53.34,58.42 54.93,56.83 R30.2
N$42
  Top 1.016: R29.1 84.14,53.81 D13.1 84.14,52.07 83.19,51.12 D13.3 83.19,49.85 83.35,49.68 R28.2
  Top 1.27: T19.1 87.63,59.69 86.68,58.74 86.68,56.68 R29.1
N$43
  Top 1.422: D16.A D15.A
N$45
  Top 1.016: T24.B 62.39,52.38 R32.2
N$46
  Top 0.813: R33.2 90.81,50.16 90.17,50.8 T23.B
PWM1
  Top 0.61: IC1.10 44.04,21.5 40.01,17.46 38.42,17.46 38.1,17.14 38.1,13.17 R4.1 34.46,13.34 34.61,13.02 33.66,13.97 33.66,16.19 32.7,17.14 17.78,17.14 13.8,13.17 R5.1
PWM2/MOSI
  Top 0.406: IC1.15 48.04,21.81 48.26,21.59 54.61,21.59 57.78,24.77 67.31,24.77 68.26,23.81 68.26,17.46 68.58,17.14
  Top 0.61: R12.1 66.51,16.03 67.63,17.14 68.58,17.14 R11.1
  Top 0.813: 89.22,18.73 88.9,18.41 85.72,18.41 85.09,19.05 81.92,19.05 80.96,18.1 80.96,17.3 R11.1
  Top 1.422: ISP.1 89.22,18.73
PWM3  (via drill 0.8 pad 1.68)
  Top 0.406: 36.83,46.99 33.02,46.99 | 20.32,46.99 16.83,46.99 | IC1.9 43.02,23.01 42.86,22.86
  Top 0.813: R20.1 37.31,47.47 36.83,46.99 | 16.83,46.99 16.19,46.35 14.77,46.35 R19.1
  Top 1.016: 33.02,46.99 26.35,46.99 | 26.35,46.99 20.32,46.99 | 42.86,22.86 42.86,22.54 40.32,20 34.92,20 33.97,20.95 24.13,20.95 v22.86,22.23 | v26.35,40.64 26.35,46.99
  Bottom 1.27: v22.86,22.23 24.77,22.23 26.35,23.81 v26.35,40.64
PWM4
  Top 0.406: IC1.1 40.06,30.11 37.15,33.02 34.92,33.02 34.29,33.66
  Top 0.813: 34.29,33.66 32.07,35.88 32.07,39.05 33.97,40.96 36.83,40.96 40.32,44.45 54.29,44.45 56.2,42.55 69.22,42.55 71.75,45.09 71.75,45.87 R27.1
  Top 1.27: R28.1 78.91,46.84 78.11,46.04 R27.1
RESET
  Top 0.406: IC1.29 45.64,34.05 44.77,34.92 42.86,34.92 42.23,35.56 42.23,38.1 BUS.4
  Top 0.813: 91.76,25.72 91.76,30.48 92.39,31.11 96.2,31.11 96.84,31.75 96.84,34.29 96.2,34.92 83.82,34.92 79.38,39.37 54.61,39.37 52.39,41.59 44.13,41.59 43.5,40.96 BUS.4
  Top 1.27: R1.2 92.54,23.03 91.76,23.81 91.76,25.72 ISP.5
SCL
  Top 0.406: IC1.28 46.44,34.84 46.04,35.24 BUS.5
SDA
  Top 0.406: IC1.27 47.24,37.85 46.99,38.1 44.77,38.1 BUS.3

### Text on the board
Top: TOP | Slomkowski | 2012 | Michal
Bottom: Michal Slomkowski | BOTT